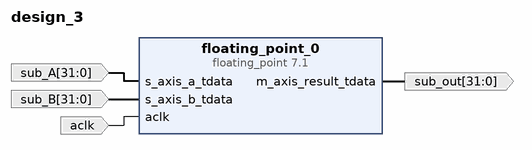
[diagram p0: block diagram of the top level]
# Vivado block design design_3, Vivado 2015.4
create_bd_design design_3

create_bd_port -dir I -from 31 -to 0 -type data sub_A
create_bd_port -dir I -from 31 -to 0 -type data sub_B
create_bd_port -dir I -type clk aclk
set_property -dict {CONFIG.FREQ_HZ 10000000} [get_bd_ports aclk]
create_bd_port -dir O -from 31 -to 0 -type data sub_out

create_bd_cell -type ip -vlnv xilinx.com:ip:floating_point:7.1 floating_point_0
set_property -dict {CONFIG.Add_Sub_Value Add} [get_bd_cells floating_point_0]

# ---- connections ----

connect_bd_net [get_bd_ports sub_A] [get_bd_pins floating_point_0/s_axis_a_tdata]
connect_bd_net [get_bd_ports sub_B] [get_bd_pins floating_point_0/s_axis_b_tdata]
connect_bd_net [get_bd_ports aclk] [get_bd_pins floating_point_0/aclk]
connect_bd_net [get_bd_pins floating_point_0/m_axis_result_tdata] [get_bd_ports sub_out]

validate_bd_design
save_bd_design
